# EAGLE design Adafruit TPA2016D2 (EAGLE 6.3)
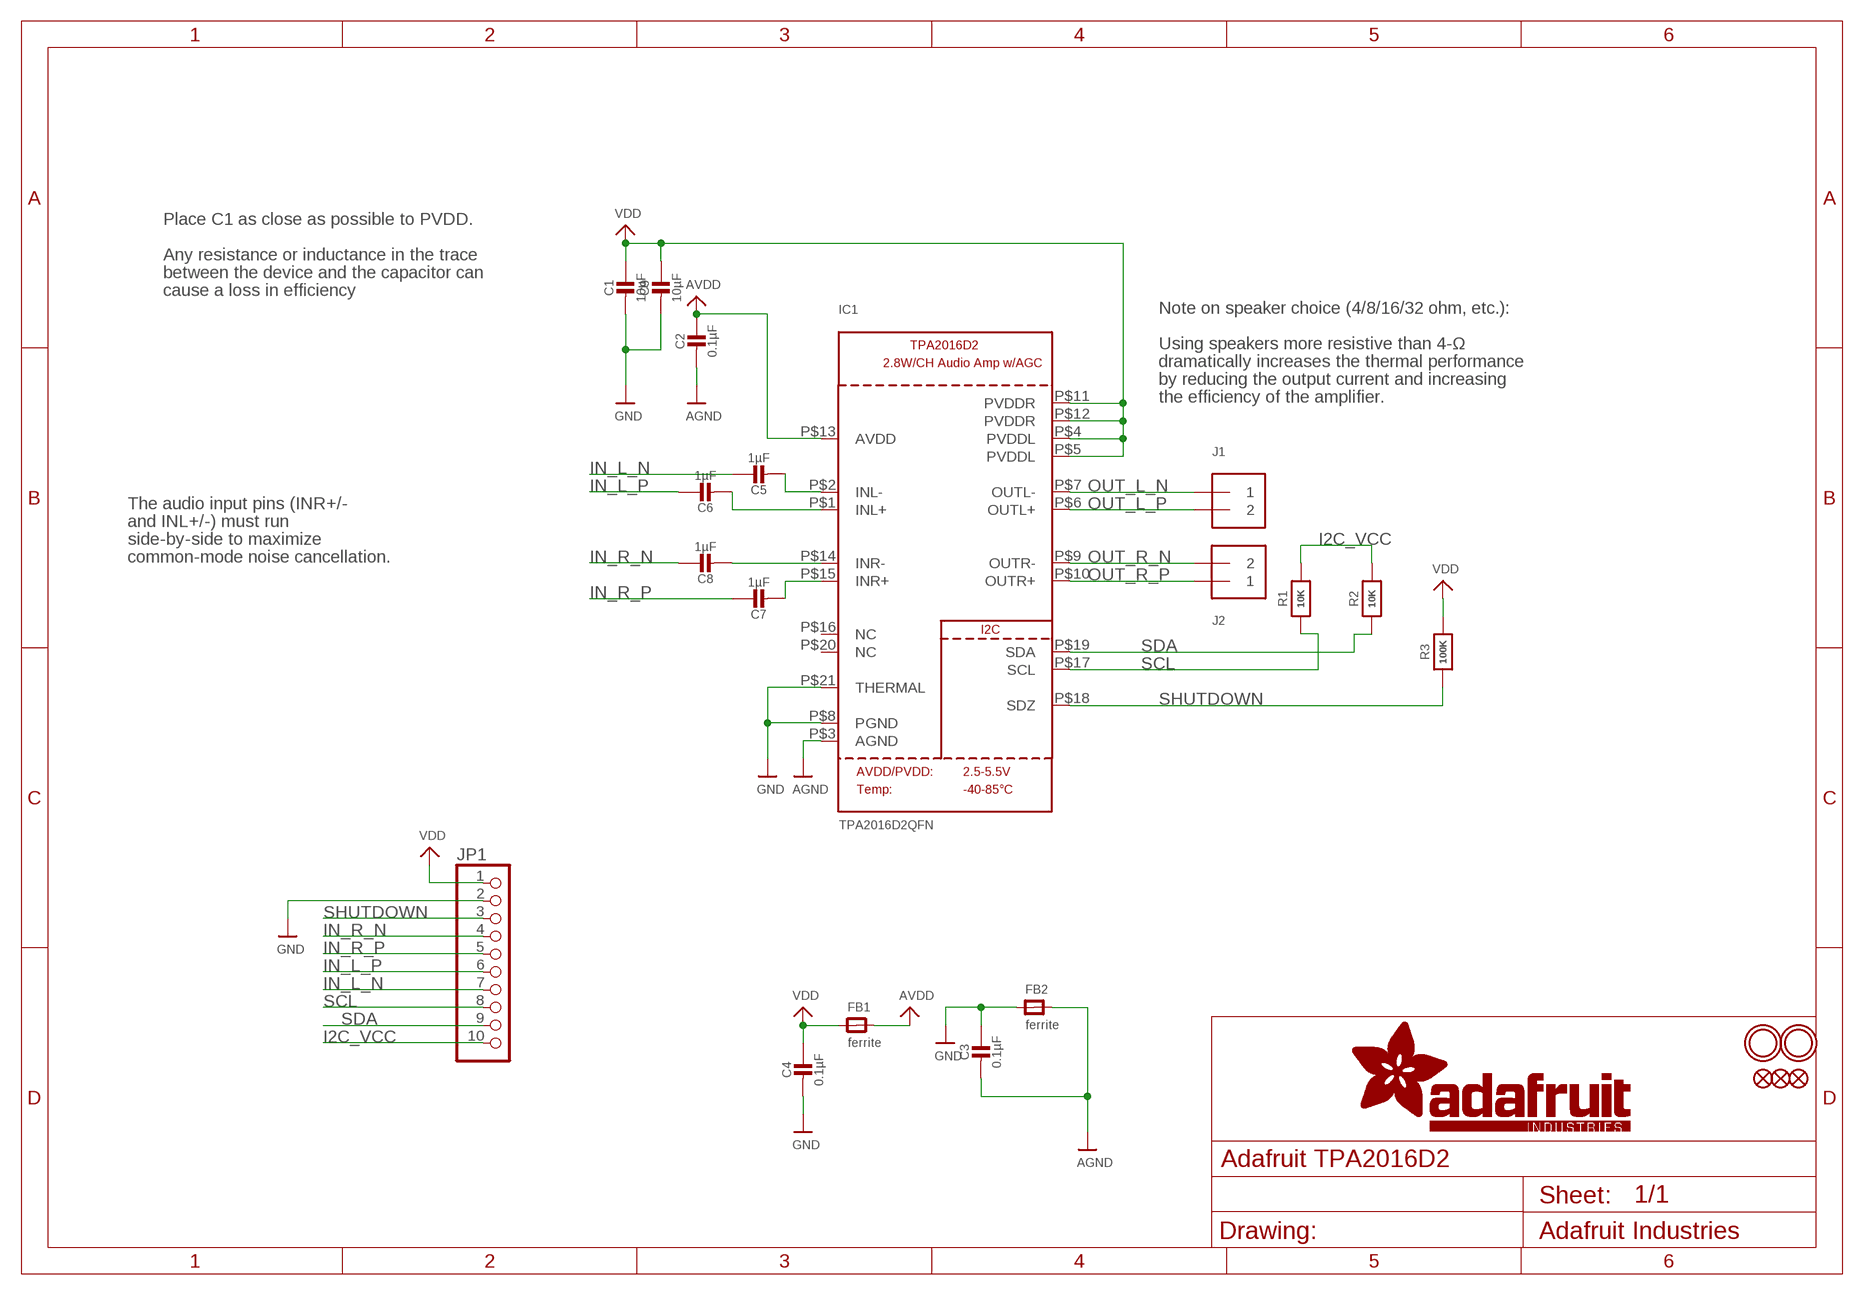
[diagram p0: schematic, sheet 1]

## Parts
C1  10µF  CAP_CERAMIC0805-NOOUTLINE  [0805-NO]
C2  0.1µF  CAP_CERAMIC0805-NOOUTLINE  [0805-NO]
C3  0.1µF  CAP_CERAMIC0805-NOOUTLINE  [0805-NO]
C4  0.1µF  CAP_CERAMIC0805-NOOUTLINE  [0805-NO]
C5  1µF  CAP_CERAMIC0805-NOOUTLINE  [0805-NO]
C6  1µF  CAP_CERAMIC0805-NOOUTLINE  [0805-NO]
C7  1µF  CAP_CERAMIC0805-NOOUTLINE  [0805-NO]
C8  1µF  CAP_CERAMIC0805-NOOUTLINE  [0805-NO]
C9  10µF  CAP_CERAMIC0805-NOOUTLINE  [0805-NO]
FB1  ferrite  FERRITE_0805MP  [_0805MP]
FB2  ferrite  FERRITE_0805MP  [_0805MP]
FID1  FIDUCIAL""  [FIDUCIAL_1MM]
FID2  FIDUCIAL""  [FIDUCIAL_1MM]
FID3  FIDUCIAL""  [FIDUCIAL_1MM]
IC1  TPA2016D2QFN  [QFN20_4MM]
J1  TERMBLOCK_1X2  [TERMBLOCK_1X2-3.5MM]
J2  TERMBLOCK_1X2  [TERMBLOCK_1X2-3.5MM]
JP1  HEADER-1X1070MIL  [1X10_ROUND70]
R1  10K  RESISTOR0805_NOOUTLINE  [0805-NO]
R2  10K  RESISTOR0805_NOOUTLINE  [0805-NO]
R3  100K  RESISTOR0805_NOOUTLINE  [0805-NO]
U$20  MOUNTINGHOLE2.5_THICK  [MOUNTINGHOLE_2.5_PLATED_THICK]
U$21  MOUNTINGHOLE2.5_THICK  [MOUNTINGHOLE_2.5_PLATED_THICK]

## Nets
AGND: C2.2 C3.2 FB2.2 IC1.P$3(AGND)
AVDD: C2.1 FB1.2 IC1.P$13(AVDD)
GND: C1.2 C3.1 C4.2 C9.2 FB2.1 IC1.P$8(PGND) IC1.P$21(THERMAL) JP1.2
I2C_VCC: JP1.10 R1.2 R2.2
IN_L_N: C5.1 JP1.7
IN_L_P: C6.1 JP1.6
IN_R_N: C8.1 JP1.4
IN_R_P: C7.1 JP1.5
N$1: C6.2 IC1.P$1(INL+)
N$2: C5.2 IC1.P$2(INL-)
N$3: C8.2 IC1.P$14(INR-)
N$4: C7.2 IC1.P$15(INR+)
OUT_L_N: IC1.P$7(OUTL-) J1.1
OUT_L_P: IC1.P$6(OUTL+) J1.2
OUT_R_N: IC1.P$9(OUTR-) J2.2
OUT_R_P: IC1.P$10(OUTR+) J2.1
SCL: IC1.P$17(SCL) JP1.8 R1.1
SDA: IC1.P$19(SDA) JP1.9 R2.1
SHUTDOWN: IC1.P$18(SDZ) JP1.3 R3.1
VDD: C1.1 C4.1 C9.1 FB1.1 IC1.P$4(PVDDL) IC1.P$5(PVDDL) IC1.P$11(PVDDR) IC1.P$12(PVDDR) JP1.1 R3.2
Unconnected: IC1.P$16(NC) IC1.P$20(NC)

## Notes on the sheet
- Place C1 as close as possible to PVDD.
- Any resistance or inductance in the trace
- between the device and the capacitor can
- cause a loss in efficiency
- Note on speaker choice (4/8/16/32 ohm, etc.):
- Using speakers more resistive than 4-Ω
- dramatically increases the thermal performance
- by reducing the output current and increasing
- the efficiency of the amplifier.
- The audio input pins (INR+/-
- and INL+/-) must run
- side-by-side to maximize
- common-mode noise cancellation.

## Library data of the parts
C1-C9 = microbuilder:CAP_CERAMIC: Ceramic Capacitors For new designs, use the packages preceded by an '_' character since they are more reliable: The following footprints should be used on most boards: _0402 - Standard footprint for regular board layouts _0603 - Standard footprint for regular board layouts _0805 - Standard footprint for regular board layouts _1206 - Standard footprint for regular board layouts For extremely tight-pitch boards where space is at a premium, the following 'micro-pitch' footprints can be used (smaller pads, no silkscreen outline, etc.): _0402MP - Micro-pitch footprint for very dense/compact boards _0603MP - Micro-pitch footprint for very dense/compact boards _0805MP - Micro-pitch footprint for very dense/compact boards _1206MP - Micro-pitch footprint for very dense/compact boards
FB1 FB2 = microbuilder:FERRITE: Ferrite Bead 0603 MMZ1608B121C - 120 Ohm @ 100MHz, 600mA, 0.15 Ohm DC Resistance - Digikey: 445-2164-1-ND BK1608HW121-T - 120 Ohm, 600mA Ferrite Chip - Digikey: 587-1876-2-ND 0805 HZ0805B272R-10 - 2.7K Ohm @ 100MHz, 200mA, 0.8 Ohm DC Resistance - Digikey: 240-2504-1-ND (see also Murata BLM21BD272SN1L) MMZ2012Y152B - 1.5K Ohm @ 100MHz, 500mA, 0.4 Ohm DC Resistance - Digikey: 445-1560-1-ND - Mainly for high frequency (80-400MHz) MMZ2012R102A - 1K Ohm @ 100MHz, 500mA, 0.3 Ohm DC Resistance - Digikey: 445-1555-2-ND - More general purpose (10-200MHz)
FID1-FID3 = microbuilder:FIDUCIAL: Fiducial Alignment Points Various fiducial points for machine vision alignment.; BOM: EXCLUDE
IC1 = microbuilder:TPA2016D2
J1 J2 = microbuilder:TERMBLOCK_1X2: 3.5mm Terminal block http://www.ladyada.net/library/pcb/eaglelibrary.html
JP1 = microbuilder:HEADER-1X10: PIN HEADER
R1-R3 = microbuilder:RESISTOR: Resistors For new designs, use the packages preceded by an '_' character since they are more reliable: The following footprints should be used on most boards: _0402 - Standard footprint for regular board layouts _0603 - Standard footprint for regular board layouts _0805 - Standard footprint for regular board layouts _1206 - Standard footprint for regular board layouts For extremely tight-pitch boards where space is at a premium, the following 'micro-pitch' footprints can be used (smaller pads, no silkscreen outline, etc.): _0402MP - Micro-pitch footprint for very dense/compact boards _0603MP - Micro-pitch footprint for very dense/compact boards _0805MP - Micro-pitch footprint for very dense/compact boards _1206MP - Micro-pitch footprint for very dense/compact boards
U$20 U$21 = microbuilder:MOUNTINGHOLE: Mounting Hole For #2 screws (0.086"/2.18mm width, 0.094"/2.4mm hole) use 2.5mm; BOM: EXCLUDE

## Board
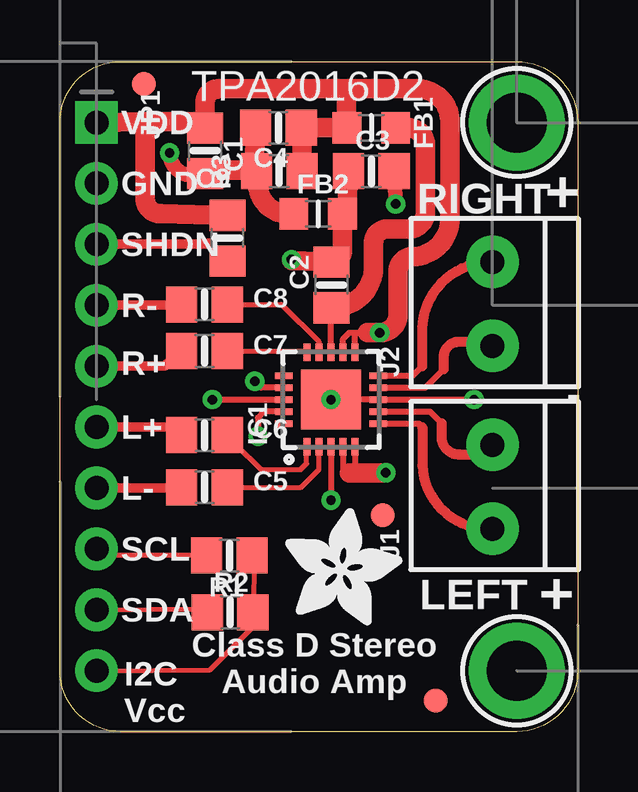
[diagram p1: board, top side]
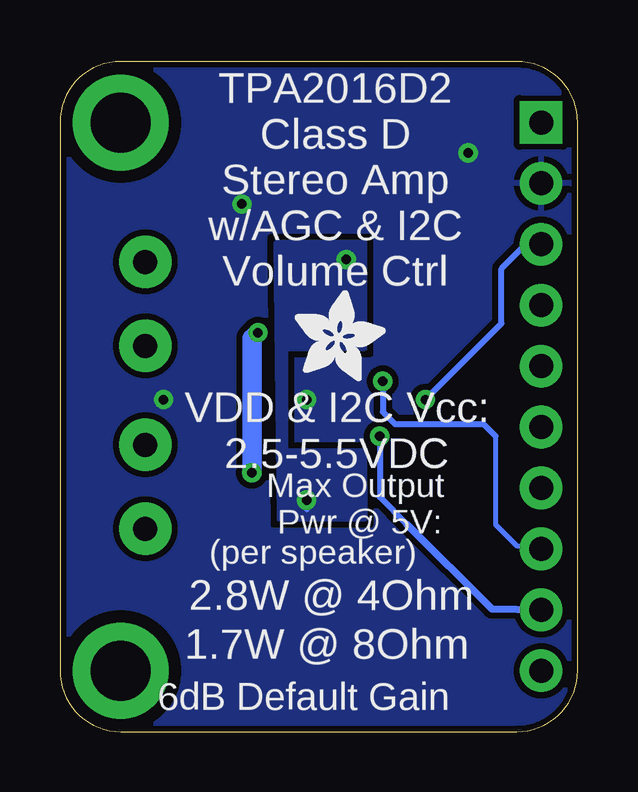
[diagram p2: board, bottom side, seen from below]

Size 21.59 x 27.94 mm. Coordinates in mm from the lower left corner, seen from the top.
Outline: 2.54,27.94 19.05,27.94 arc-90 21.59,25.4 21.59,2.54 arc-90 19.05,0 2.54,0 arc-90 0,2.54 0,25.4 arc-90 2.54,27.94
Copper layers (1*16): Top 0.035mm / dielectric 1.5mm / Bottom 0.035mm
Design rules "adafruit": minimum track width 8mil, minimum drill 15.5mil, track to track 8mil, track to pad 8mil, pad to pad 8mil, via to via 8mil, smd to smd 8mil, copper to edge 10mil, drill to drill 8mil, minimum pad ring 10mil, minimum via ring 8mil, stop-mask expansion 4mil, vias tented up to drill 20mil, thermal gap 10mil

### Footprints (pad centres in the part's own frame; a part is rotated, then mirrored left to right if it is on the bottom)
0805-NO = smd 1.3 x 1.5: 1 -0.95,0; 2 0.95,0
_0805MP = smd 1.2 x 1.3: 1 -1.016,0; 2 1.016,0
FIDUCIAL_1MM = smd 1 x 1: 1 0,0
QFN20_4MM = smd 0.73 x 0.28: P$1 -1.965,1; P$2 -1.965,0.5; P$3 -1.965,0; P$4 -1.965,-0.5; P$5 -1.965,-1; P$11 1.965,-1; P$12 1.965,-0.5; P$13 1.965,0; P$14 1.965,0.5; P$15 1.965,1 | smd 0.28 x 0.73: P$6 -1,-1.965; P$7 -0.5,-1.965; P$8 0,-1.965; P$9 0.5,-1.965; P$10 1,-1.965; P$16 1,1.965; P$17 0.5,1.965; P$18 0,1.965; P$19 -0.5,1.965; P$20 -1,1.965 | smd 2.5 x 2.5: P$21 0,0
TERMBLOCK_1X2-3.5MM = drill 1 pad 2.184: 1 1.8,0; 2 -1.7,0
1X10_ROUND70 = drill 1 pad 1.778 square: 1 -11.43,0 | drill 1 pad 1.778: 2 -8.89,0; 3 -6.35,0; 4 -3.81,0; 5 -1.27,0; 6 1.27,0; 7 3.81,0; 8 6.35,0; 9 8.89,0; 10 11.43,0
MOUNTINGHOLE_2.5_PLATED_THICK = drill 2.5 pad 4: P$1 0,0

### Placement (x,y rotation side)
C1  6.05,24.21 270 top
C2  11.32,18.62 90 top
C3  12.98,23.36 180 top
C4  9.11,25.18 180 top
C5  6.03,10.19 0 top
C6  6.03,12.36 0 top
C7  6.03,15.87 0 top
C8  6.03,17.81 0 top
C9  9.14,23.37 180 top
FB1  12.98,25.18 0 top
FB2  10.76,21.59 0 top
FID1  3.49,27 0 top
FID2  15.67,1.3 0 top
FID3  13.46,9.02 0 top
IC1  11.3,13.84 90 top
J1  18.03,10.16 90 top
J2  18.03,17.78 90 top
JP1  1.52,13.97 270 top
R1  7.07,7.34 0 top
R2  7.09,4.98 0 top
R3  6.99,20.57 90 top
U$3  [ADAFRUIT_5MM]  9.4,4.45 0 top
U$4  [ADAFRUIT_3.5MM]  11.81,14.61 0 bottom
U$20  19.05,2.54 0 top
U$21  19.05,25.4 0 top

### Tracks (layer width: path | path; a pad name or v marks a point on that pad's centre or on a via)
AGND  (via drill 0.39)
  Top 0.254: IC1.P$3 v11.3,9.65
  Top 0.813: C3.2 11.97,21.78 arc-90 FB2.2 11.78,20.09 arc-90 C2.2 9.7,19.64 arc-90 v9.65,19.68
  Bottom 0.254: v11.3,9.65 11.3,9.27
  pour Bottom (isolate 0.254): 12.57,20.36 12.44,8.89 8.87,8.89 8.89,11.68 12.19,11.68 12.19,16 8.89,16 8.89,20.36
AVDD
  Top 0.254: IC1.P$13 11.3,17.59 C2.1
  Top 0.813: FB1.2 14.45,25.18 arc-90 15.24,24.51 15.24,21.59 arc-90 14.48,20.95 13.59,20.95 arc90 13.08,20.32 13.08,19.36 arc-90 C2.1
GND  (via drill 0.39)
  Top 0.254: v17.27,13.84 IC1.P$8 IC1.P$21
  Top 0.61: C3.1 v14,22 | C1.2 5.5,23.2 arc-90 v4.57,24.13
  Top 0.813: C4.2 8.1,23.4 | 8.1,23.4 arc90 C9.2 arc-90 8.26,23.24 8.26,22.99 arc90 9.4,21.59 FB2.1 | 8.1,23.4 6.26,23.4 arc90 C1.2
  other vias: 11.3,13.84
  pour Bottom (isolate 0.254, rank 2): 0,28 22,28 22,0 0,0
I2C_VCC
  Top 0.203: R1.2 8.11,7.31 R2.2 8.13,4.96 8.13,4.45 6.25,2.57 JP1.10
IN_L_N
  Top 0.406: JP1.7 4.88,10.19 C5.1
IN_L_P
  Top 0.406: JP1.6 4.51,12.73 C6.1
IN_R_N
  Top 0.406: JP1.4 4.88,17.81 C8.1
IN_R_P
  Top 0.406: JP1.5 4.41,15.27 C7.1
N$1
  Top 0.203: C6.2 7.33,11.98 8.38,10.92 10.03,10.92 10.29,11.18 10.29,11.86 IC1.P$1
N$2
  Top 0.203: C5.2 10.06,10.19 10.79,10.92 IC1.P$2
N$3
  Top 0.203: C8.2 9.24,17.81 10.79,16.26 IC1.P$14
N$4
  Top 0.203: C7.2 10.24,15.87 IC1.P$15
OUT_L_N
  Top 0.254: IC1.P$7 15.43,13.34 15.91,12.86
  Top 0.406: 15.91,12.86 15.91,12.28 arc90 16.64,11.56 18.07,11.56 arc90 J1.1
OUT_L_P
  Top 0.254: IC1.P$6 14.97,12.84 15.11,12.7
  Top 0.406: 15.11,12.7 15.11,11.1 arc90 J1.2
OUT_R_N
  Top 0.254: IC1.P$9 15.23,14.34 16,15.11
  Top 0.406: 16,15.11 16,15.62 arc-90 16.64,16.26 18.07,16.26 arc90 J2.2
OUT_R_P
  Top 0.254: IC1.P$10 14.72,14.84 15.11,15.24
  Top 0.406: 15.11,15.24 15.11,16.8 arc-90 J2.1
SCL  (via drill 0.39)
  Top 0.203: R1.1 1.81,7.34 JP1.8
  Top 0.254: IC1.P$17 8.39,14.34 v8.13,14.61
  Bottom 0.203: 3.43,12.32 3.43,8.64 2.54,7.75 1.6,7.75 JP1.8
  Bottom 0.254: v8.13,14.61 8.13,13.34 7.62,12.83 3.94,12.83 3.43,12.32
SDA  (via drill 0.39)
  Top 0.203: JP1.9 5.95,5.11 R2.1
  Top 0.254: IC1.P$19 8.52,13.34 8.26,13.08 v8.26,12.32 | 6.18,5.08 R2.1
  Bottom 0.254: v8.26,12.32 8.26,9.78 7.11,8.64
  Bottom 0.305: 7.11,8.64 3.59,5.11 JP1.9
SHUTDOWN  (via drill 0.39)
  Top 0.254: v6.35,13.84 IC1.P$18 | 6.86,19.43 R3.1
  Top 0.406: JP1.3 6.19,20.35 R3.1
  Bottom 0.254: v6.35,13.84 3.17,17.02 3.17,19.3 2.16,20.32 2.16,20.35 JP1.3
VDD  (via drill 0.39)
  Top 0.254: IC1.P$12 11.8,16.38 12.06,16.64 12.19,16.64 | IC1.P$11 12.3,16.53 12.19,16.64 | 12.19,16.64 12.83,16.64 | IC1.P$4 11.8,10.8 12.06,10.79 | IC1.P$5 12.3,10.81 12.32,10.79
  Top 0.813: JP1.1 3.56,25.43 | 3.56,25.43 3.56,22.23 arc90 4.19,21.59 R3.2 | 11.94,26.8 6.6,26.8 arc90 6.05,26.25 C1.1 arc90 5.85,25.43 3.56,25.43 | C9.1 arc-90 10.13,23.4 C4.1 FB1.1 arc-90 11.94,25.2 11.94,26.8 | 12.83,16.64 v13.34,16.64 arc90 14.1,17.4 14.1,19.18 arc-90 14.73,19.81 14.86,19.81 arc90 16.26,21.59 16.26,25.4 arc90 14.99,26.8 11.94,26.8 | 12.06,10.79 12.32,10.79 v13.59,10.79
  Bottom 0.813: v13.59,10.79 13.59,16.38 v13.34,16.64

### Text on the board
tPlace: TPA2016D2 | VDD | GND | RIGHT | + | SHDN | R- | R+ | - | L+ | L- | SCL | SDA | LEFT | + | Class D Stereo / Audio Amp | I2C / Vcc
bPlace: TPA2016D2 / Class D / Stereo Amp / w/AGC & I2C / Volume Ctrl | VDD & I2C Vcc: / 2.5-5.5VDC | Max Output / Pwr @ 5V: | (per speaker) | 2.8W @ 4Ohm | 1.7W @ 8Ohm | 6dB Default Gain